# EAGLE design untitled (EAGLE 6.1)
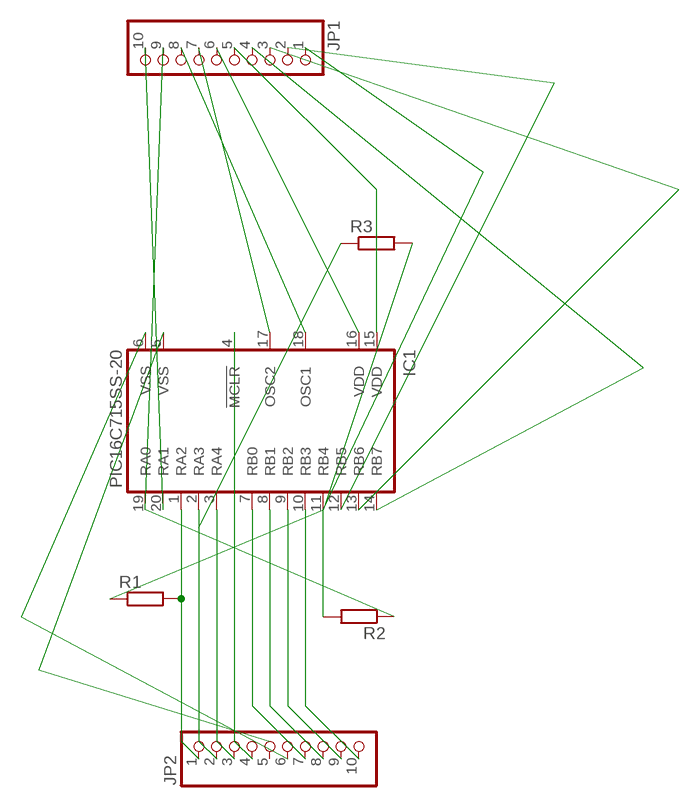
[diagram p0: schematic, sheet 1]

## Parts
IC1  PIC16C715SS-20  [SSOP20]
JP1  PINHD-1X10  [1X10]
JP2  PINHD-1X10  [1X10]
R1  R-EU_0207/10  [0207/10]
R2  R-EU_0204/2V  [0204V]
R3  R-EU_0204/2V  [0204V]

## Nets
N$1: IC1.1(RA2) JP2.1 R1.2
N$2: IC1.2(RA3) JP2.2 R3.1
N$3: IC1.3(RA4) JP2.3
N$4: IC1.4(!MCLR) JP2.4
N$5: IC1.5(VSS)
N$6: IC1.6(VSS) JP2.6
N$7: IC1.7(RB0) JP2.7
N$8: IC1.8(RB1) JP2.8
N$9: IC1.9(RB2) JP2.9
N$10: IC1.10(RB3) JP2.10
N$11: IC1.11(RB4) JP1.1 R1.1 R2.2 R3.2
N$12: IC1.12(RB5) JP1.2
N$13: IC1.13(RB6) JP1.3
N$14: IC1.14(RB7) JP1.4
N$15: IC1.15(VDD) JP1.5
N$16: IC1.16(VDD) JP1.6
N$17: IC1.17(OSC2) JP1.7
N$18: IC1.18(OSC1) JP1.8
N$19: IC1.19(RA0) JP1.9 R2.1
N$20: IC1.20(RA1) JP1.10
Unconnected: JP2.5

## Library data of the parts
IC1 = microchip:PIC16C*?-20: MICROCONTROLLER Pin compatible devices PIC16C5X family: EPROM/ROM-based PIC16C55X family: EPROM-based PIC16C6X family PIC16CE62X family: analog comparators/EEPROM data memory PIC16C7X family: A/D converter PIC16C71X family: A/D converter Pin compatible devices: PIC16C154, PIC16CR154, PIC16C156, PIC16CR156, PIC16C158 PIC16CR158, PIC16C52, PIC16C54, PIC16C54A, PIC16CR54A PIC16C56, PIC16C58A, PIC16CR58A, PIC16C61, PIC16C554 PIC16C556, PIC16C558, PIC16C620, PIC16C621, PIC16C622 PIC16C641, PIC16C642, PIC16C661, PIC16C662, PIC16C71 PIC16C710, PIC16C711, PIC16C715, PIC126F83, PIC16CR83 PIC16F84A, PIC16CR84; MF: MICROCHIP; MPN: PIC16C715-04/SS; OC_FARNELL: unknown; OC_NEWARK: 23C4525
JP1 JP2 = pinhead:PINHD-1X10: PIN HEADER
R1-R3 = rcl:R-EU_: RESISTOR, European symbol

## Board
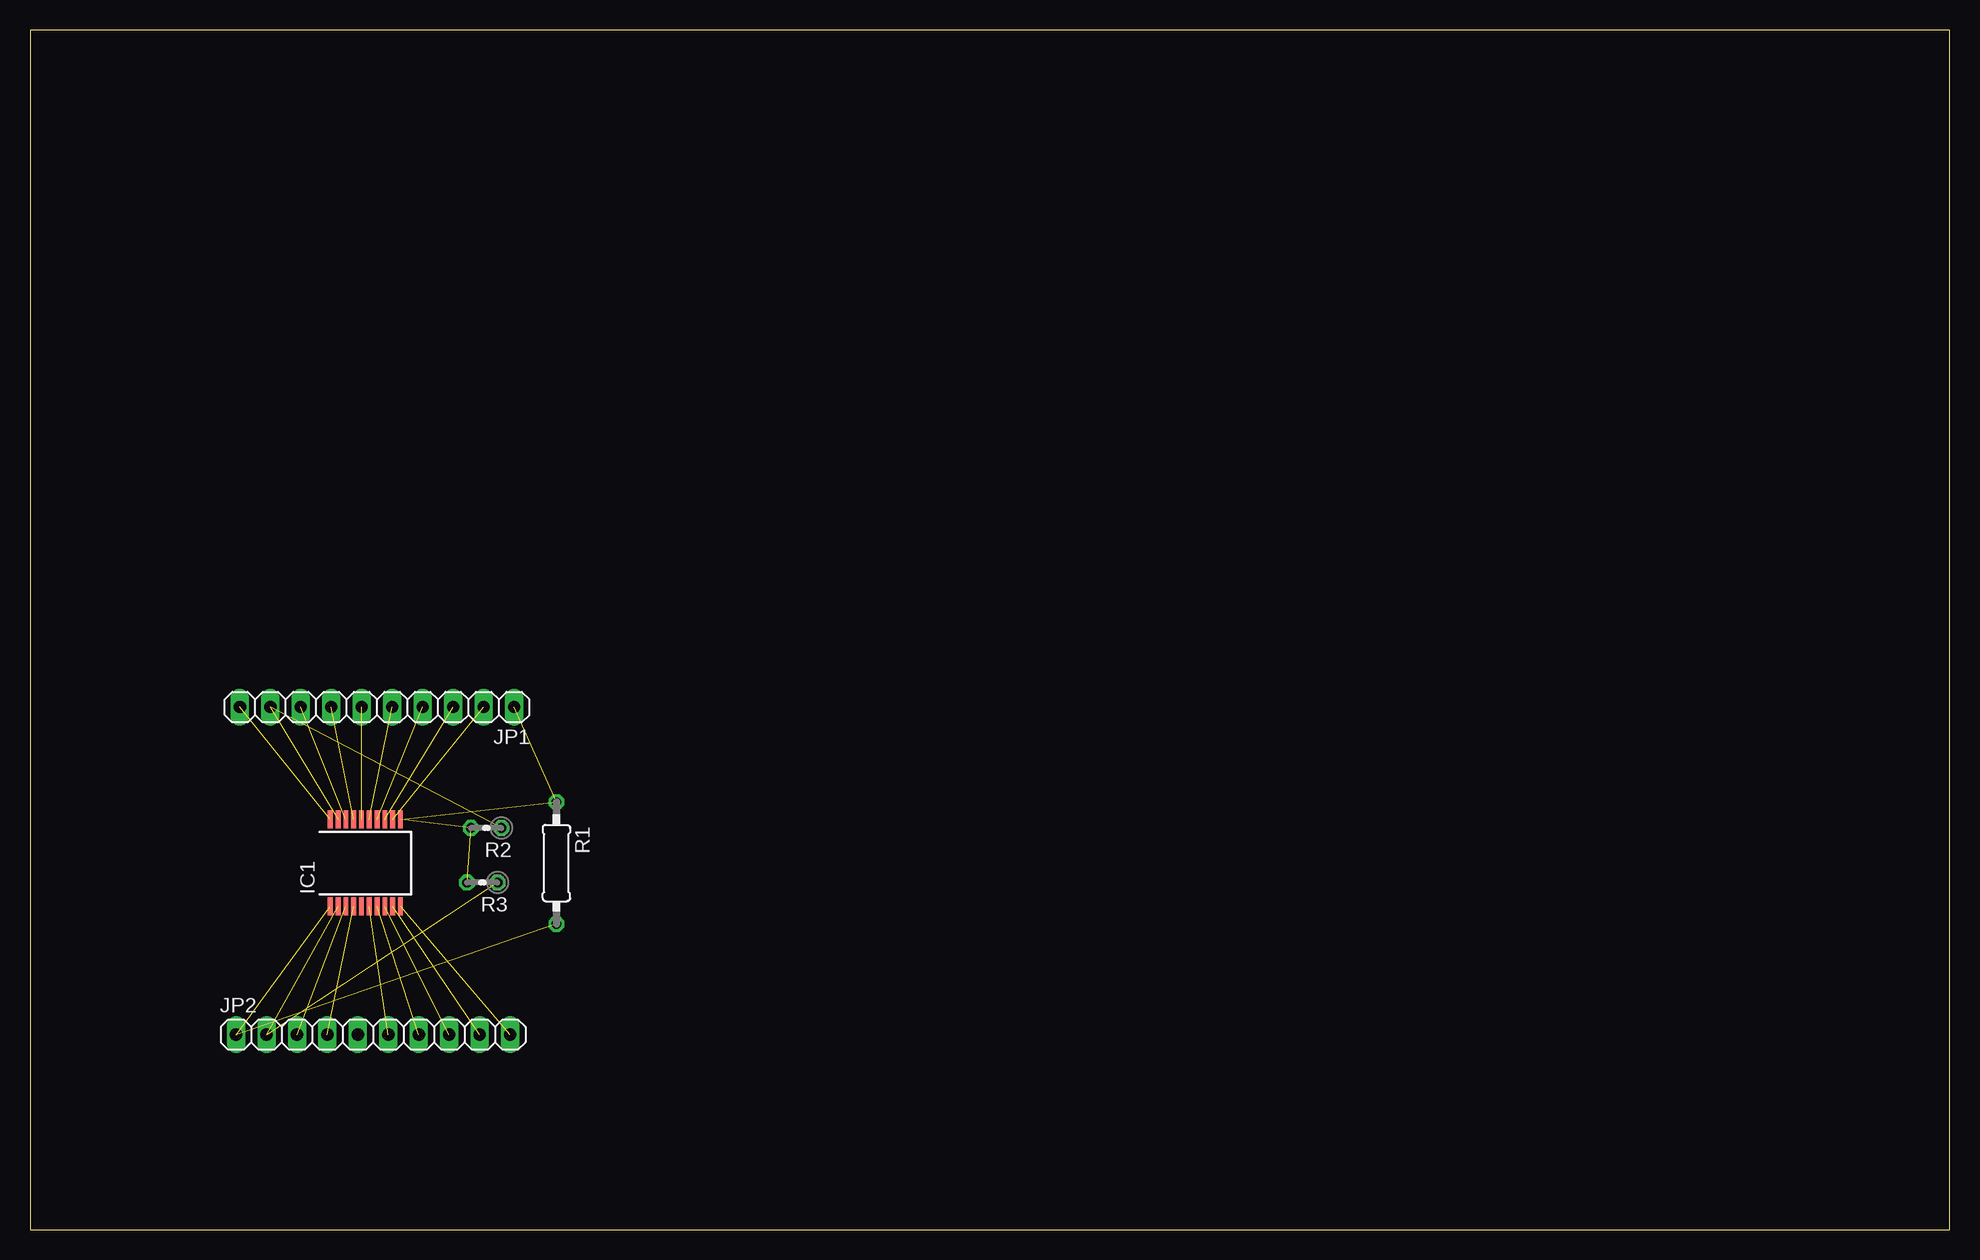
[diagram p1: board, top side]
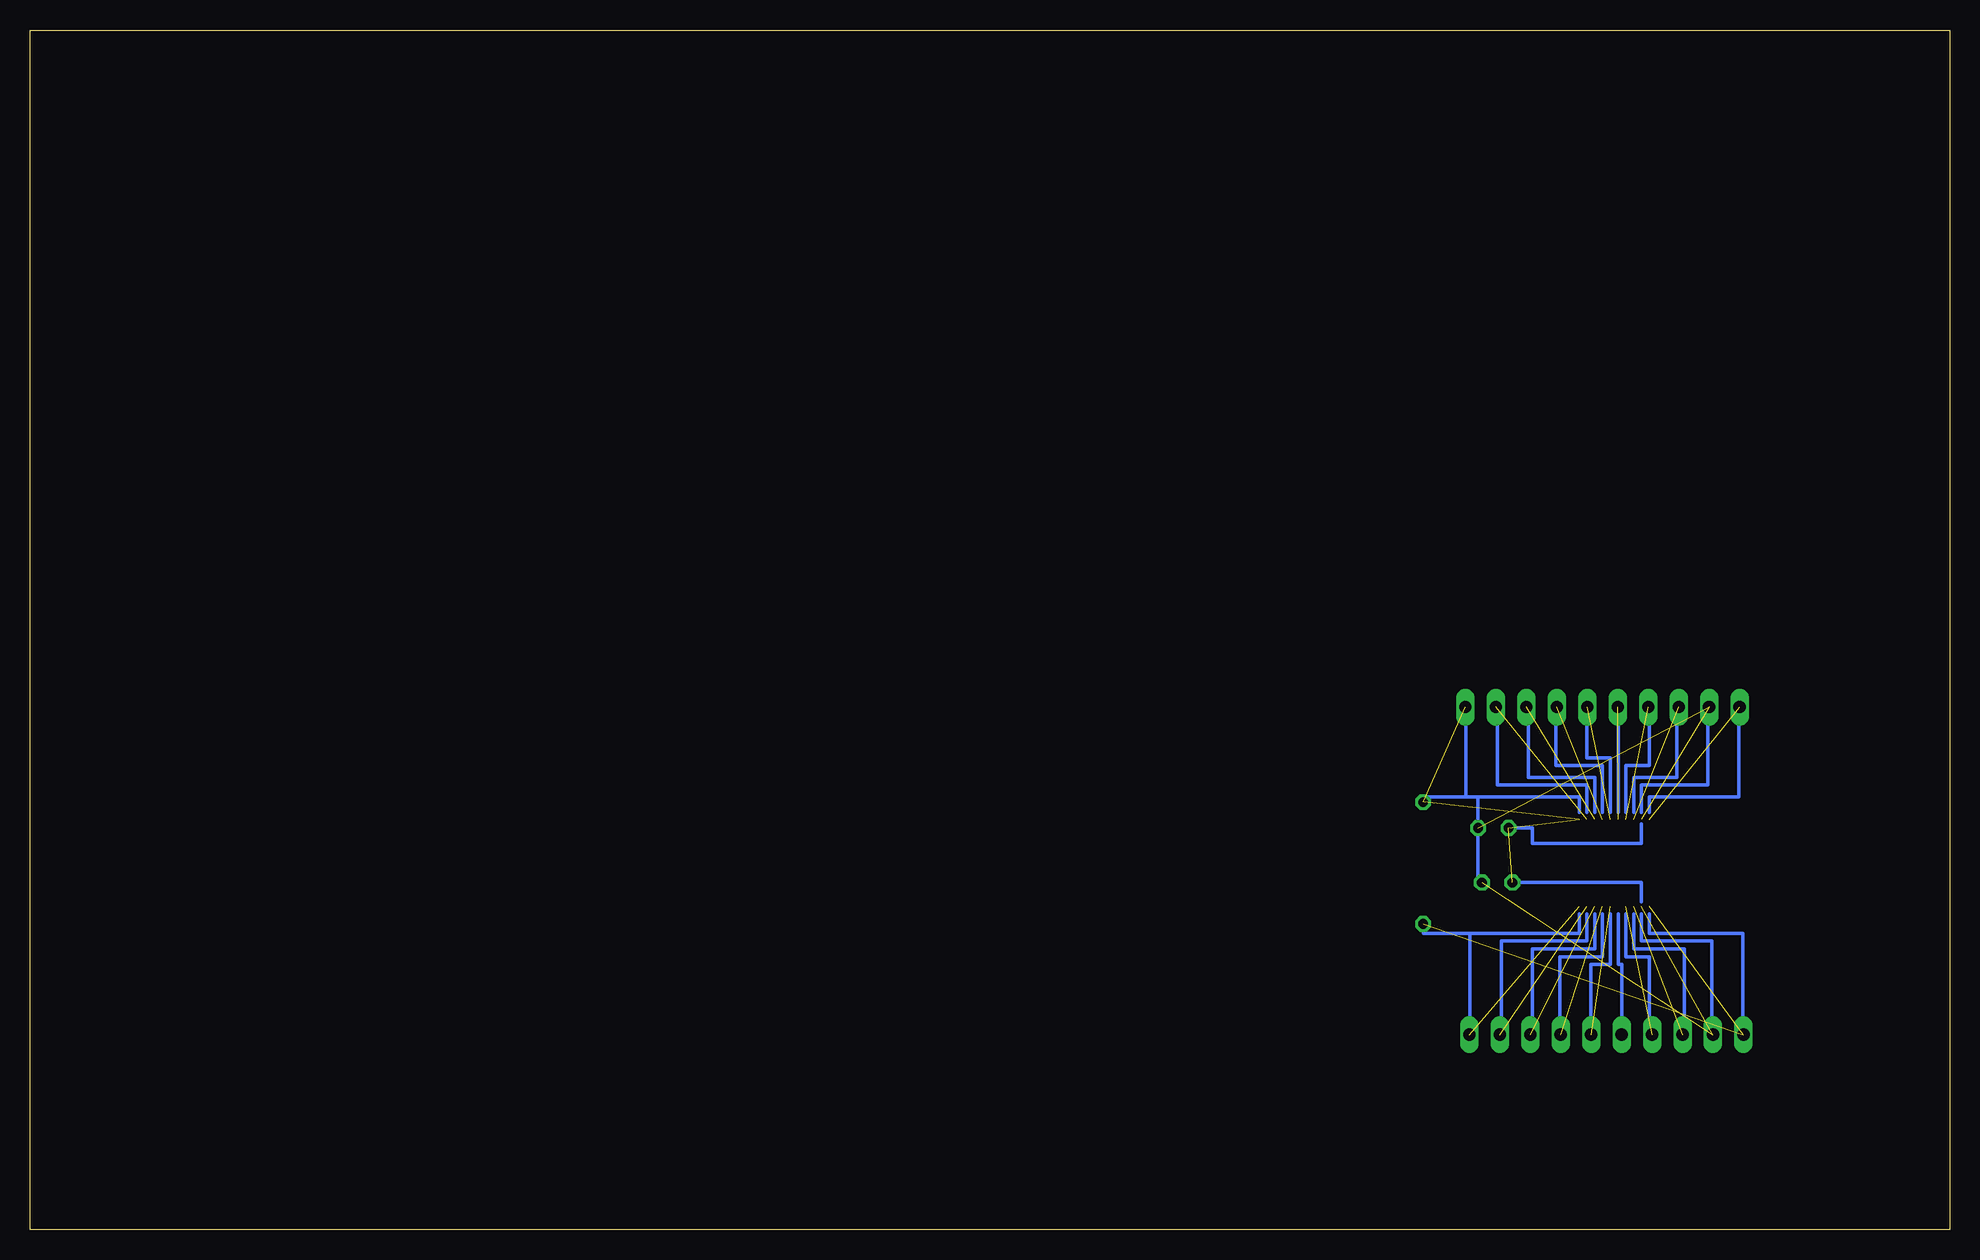
[diagram p2: board, bottom side, seen from below]

Size 160 x 100 mm. Coordinates in mm from the lower left corner, seen from the top.
Outline: 0,0 160,0 160,100 0,100 0,0
Copper layers (1*16): Top 0.035mm / dielectric 1.5mm / Bottom 0.035mm
Design rules: minimum track width 10mil, minimum drill 24mil, track to track 8mil, track to pad 8mil, pad to pad 8mil, via to via 8mil, smd to smd 8mil, copper to edge 40mil, drill to drill 8mil, minimum pad ring 10mil, minimum via ring 8mil, stop-mask expansion 4mil, vias tented up to drill 0mil, thermal gap 10mil

### Footprints (pad centres in the part's own frame; a part is rotated, then mirrored left to right if it is on the bottom)
SSOP20 = smd 0.4 x 1.5: 1 -2.925,-3.625; 2 -2.275,-3.625; 3 -1.625,-3.625; 4 -0.975,-3.625; 5 -0.325,-3.625; 6 0.325,-3.625; 7 0.975,-3.625; 8 1.625,-3.625; 9 2.275,-3.625; 10 2.925,-3.625; 11 2.925,3.625; 12 2.275,3.625; 13 1.625,3.625; 14 0.975,3.625; 15 0.325,3.625; 16 -0.325,3.625; 17 -0.975,3.625; 18 -1.625,3.625; 19 -2.275,3.625; 20 -2.925,3.625
1X10 = drill 1.016 long: 1 -11.43,0; 2 -8.89,0; 3 -6.35,0; 4 -3.81,0; 5 -1.27,0; 6 1.27,0; 7 3.81,0; 8 6.35,0; 9 8.89,0; 10 11.43,0
0207/10 = drill 0.813 octagon: 1 -5.08,0; 2 5.08,0
0204V = drill 0.813 octagon: 1 -1.27,0; 2 1.27,0

### Placement (x,y rotation side)
IC1  27.95,30.55 0 top
JP1  28.93,43.55 180 top
JP2  28.6,16.25 0 top
R1  43.88,30.55 270 top
R2  38.02,33.48 180 top
R3  37.7,28.93 180 top

### Tracks (layer width: path | path; a pad name or v marks a point on that pad's centre or on a via)
N$1  (2 unrouted)
N$2  (2 unrouted)
N$3  (1 unrouted)
N$4  (1 unrouted)
N$6  (1 unrouted)
N$7  (1 unrouted)
N$8  (1 unrouted)
N$9  (1 unrouted)
N$10  (1 unrouted)
N$11  (4 unrouted)
N$12  (1 unrouted)
N$13  (1 unrouted)
N$14  (1 unrouted)
N$15  (1 unrouted)
N$16  (1 unrouted)
N$17  (1 unrouted)
N$18  (1 unrouted)
N$19  (2 unrouted)
N$20  (1 unrouted)
N$21
  Bottom 0.3: 25.02,34.77 25.02,36.08 17.55,36.08 17.55,42.58
N$22
  Bottom 0.3: 25.68,34.77 25.68,37.05 20.15,37.05 20.15,42.25
N$23
  Bottom 0.3: 26.32,34.77 26.32,37.7 22.75,37.7 22.75,42.58
N$24
  Bottom 0.3: 26.98,34.77 26.98,38.67 25.02,38.67 25.02,42.25
N$25
  Bottom 0.3: 27.62,34.77 27.62,42.25
N$27
  Bottom 0.3: 30.23,34.77 30.23,37.05 37.7,37.05 37.7,42.25
N$28
  Bottom 0.3: 29.57,34.77 29.57,37.7 35.1,37.7 35.1,42.58
N$29
  Bottom 0.3: 28.93,34.77 28.93,38.67 32.83,38.67 32.83,42.25
N$30
  Bottom 0.3: 28.27,34.77 28.27,39.33 30.23,39.33 30.23,42.25
N$31
  Bottom 0.3: 25.02,26.32 25.02,24.7 17.23,24.7 17.23,17.55
N$32
  Bottom 0.3: 25.68,26.32 25.68,24.05 19.82,24.05 19.82,17.23
N$33
  Bottom 0.3: 26.32,26.32 26.32,23.4 22.1,23.4 22.1,17.55
N$34
  Bottom 0.3: 26.98,26.32 26.98,22.75 25.02,22.75 25.02,17.55
N$35
  Bottom 0.3: 27.62,26.32 27.62,22.1 27.3,22.1 27.3,17.55
N$36
  Bottom 0.3: 30.88,26.32 30.88,24.7 39.98,24.7 | 39.98,24.7 39.98,17.55 | 39.98,24.7 43.88,24.7 43.88,25.35
N$37
  Bottom 0.3: 30.23,26.32 30.23,24.05 37.38,24.05 37.38,17.55
N$38
  Bottom 0.3: 29.57,26.32 29.57,23.4 34.77,23.4 34.77,17.55
N$39
  Bottom 0.3: 28.93,26.32 28.93,22.75 32.5,22.75 32.5,17.55
N$40
  Bottom 0.3: 28.27,26.32 28.27,22.1 29.9,22.1 29.9,17.55
N$41
  Bottom 0.3: 25.68,27.3 25.68,28.93 36.4,28.93
N$42
  Bottom 0.3: 25.68,33.8 25.68,32.17 34.77,32.17 34.77,33.48 36.73,33.48
N$43
  Bottom 0.3: 39,28.93 39.33,28.93 39.33,36.08 | 30.88,34.77 30.88,36.08 39.33,36.08 | 39.33,36.08 40.3,36.08 | 40.3,36.08 40.3,42.58 | 43.88,35.75 43.88,36.08 40.3,36.08